# Altium project PShield.PrjPcb
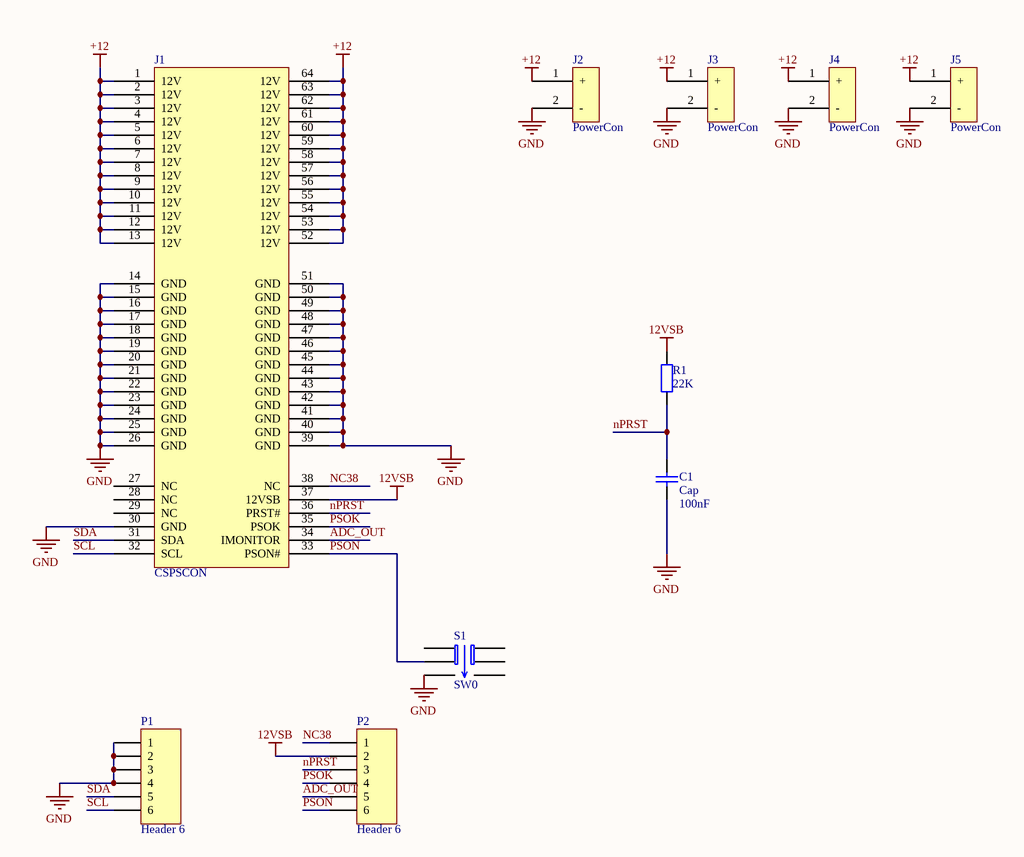
[diagram p0: CSPS.SchDoc]
1 sheet, 10 parts. Net scope: global (net labels, ports and power ports of the same name join across sheets).
Board file: CSPS.PcbDoc

## Sheet CSPS.SchDoc
size A4

### Parts
C1  Cap  value 100nF  [0402]
J1  CSPSCON  [CSPSCON2]
J2  PowerCon  [XT60PB]
J3  PowerCon  [XT60PB]
J4  PowerCon  [XT60PB]
J5  PowerCon  [XT60PB]
P1  Header 6  [HDR1X6]
P2  Header 6  [HDR1X6]
R1  value 22K  [J1-0603]  (hidden comment: Res2)
S1  SW0  [SW_TH_6P-7x7]

### Nets
12VSB: J1.37(12VSB) P2.2 R1.2
+12: J1.1(12V) J1.2(12V) J1.3(12V) J1.4(12V) J1.5(12V) J1.6(12V) J1.7(12V) J1.8(12V) J1.9(12V) J1.10(12V) J1.11(12V) J1.12(12V) J1.13(12V) J1.52(12V) J1.53(12V) J1.54(12V) J1.55(12V) J1.56(12V) J1.57(12V) J1.58(12V) J1.59(12V) J1.60(12V) J1.61(12V) J1.62(12V) J1.63(12V) J1.64(12V) J2.1(+) J3.1(+) J4.1(+) J5.1(+)
GND: C1.1 J1.14(GND) J1.15(GND) J1.16(GND) J1.17(GND) J1.18(GND) J1.19(GND) J1.20(GND) J1.21(GND) J1.22(GND) J1.23(GND) J1.24(GND) J1.25(GND) J1.26(GND) J1.30(GND) J1.39(GND) J1.40(GND) J1.41(GND) J1.42(GND) J1.43(GND) J1.44(GND) J1.45(GND) J1.46(GND) J1.47(GND) J1.48(GND) J1.49(GND) J1.50(GND) J1.51(GND) J2.2(-) J3.2(-) J4.2(-) J5.2(-) P1.1 P1.2 P1.3 P1.4 S1.3
ADC_OUT: J1.34(IMONITOR) P2.5
NC38: J1.38(NC) P2.1
nPRST: C1.2 J1.36(PRST#) P2.3 R1.1
PSOK: J1.35(PSOK) P2.4
PSON: J1.33(PSON#) P2.6 S1.2
SCL: J1.32(SCL) P1.6
SDA: J1.31(SDA) P1.5

Not connected (* = marked no-connect by the designer): J1 27(NC) 28(NC) 29(NC); S1 1(2) 4 5 6

### Library data of the parts
C1 = Cap: Capacitor; Published: 8-Jun-2000; LatestRevisionDate: 17-Jul-2002; LatestRevisionNote: Re-released for DXP Platform.; PackageReference: RAD-0.3; Publisher: Altium Limited; PackageDescription: Radial Cap, Thru-Hole; 2 Leads; 0.3 in Pin Spacing
J1 = CSPSCON: 2.54 x 64Pin Common Slot Power Supply Connector
J2-J5 = PowerCon: 2 Pin Power Connector
P1 P2 = Header 6: Header, 6-Pin; LatestRevisionDate: 17-Jul-2002; LatestRevisionNote: Re-released for DXP Platform.; Publisher: Altium Limited
R1 = Res2: Resistor; Published: 8-Jun-2000; LatestRevisionDate: 17-Jul-2002; LatestRevisionNote: Re-released for DXP Platform.; PackageReference: AXIAL-0.4; Publisher: Altium Limited; PackageDescription: Axial Device, Thru-Hole; 2 Leads; 0.4 in Pin Spacing
S1 = SW0: Latching Switch.